# EAGLE schematic OCU_PCB_Rev3 (EAGLE 9.6.2)

## Sheet 1 of 4
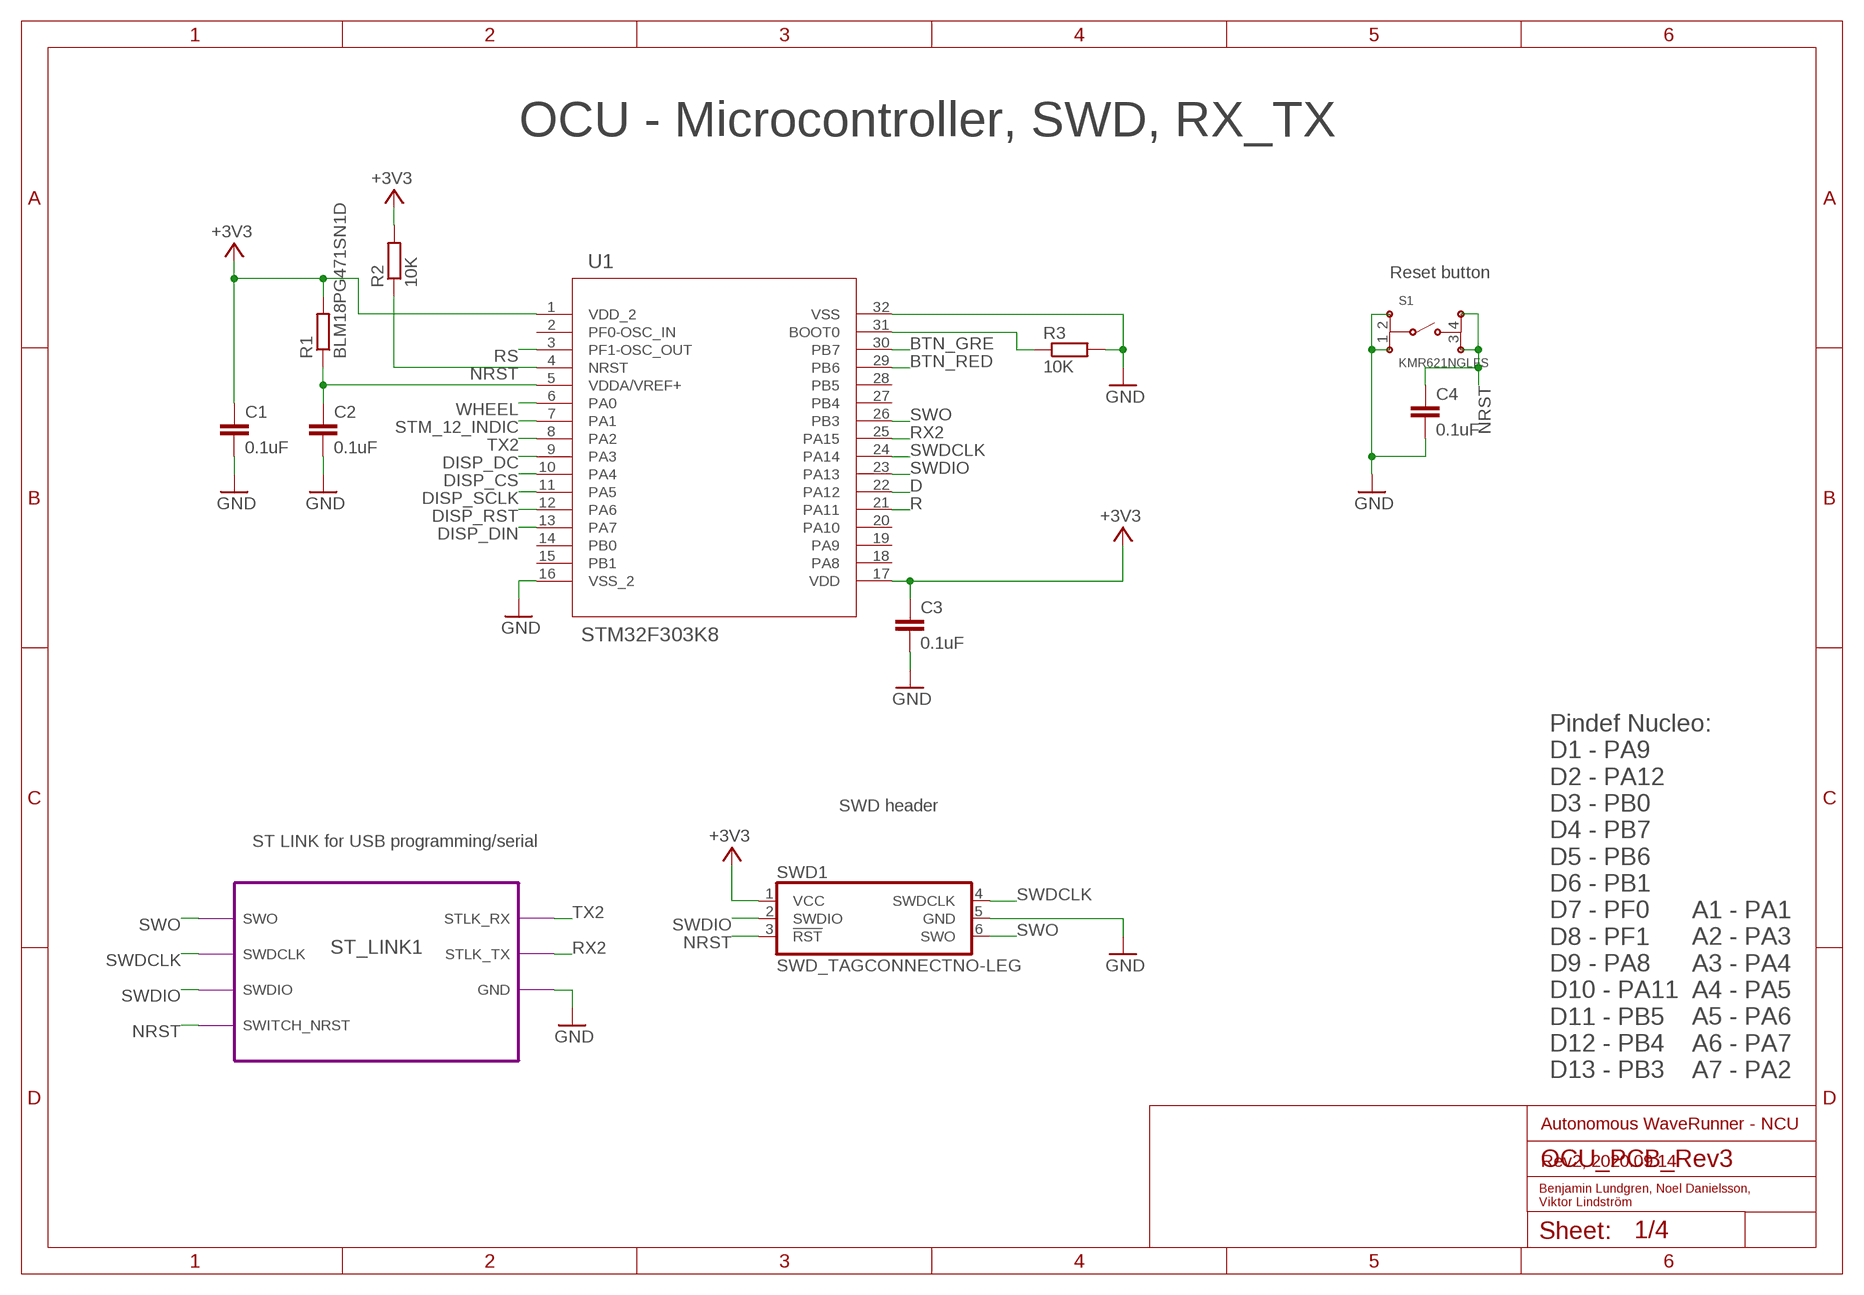
[diagram p0: schematic, sheet 1]

### Parts
C1  0.1uF  C0603  [C0603]
C2  0.1uF  C0603  [C0603]
C3  0.1uF  C0603  [C0603]
C4  0.1uF  C0603  [C0603]
R1  BLM18PG471SN1D  R0603  [R0603]
R2  10K  R0603  [R0603]
R3  10K  R0603  [R0603]
S1  KMR621NGLFS  [KMR621NGLFS]
SWD1  SWD_TAGCONNECTNO-LEG  [TC2030-IDC-NL]
U1  STM32F303K8  [LQFP-32]

### Module instances
ST_LINK1 = ST_LINKV2_1

### Nets
+3V3: C1.1 C3.1 R1.2 R2.2 SWD1.1(VCC) U1.1(VDD_2) U1.17(VDD) ; also sheet 2,3,4
BTN_GRE: U1.30(PB7) ; also sheet 3
BTN_RED: U1.29(PB6) ; also sheet 3
D: U1.22(PA12) ; also sheet 4
DISP_CS: U1.10(PA4) ; also sheet 3
DISP_DC: U1.9(PA3) ; also sheet 3
DISP_DIN: U1.13(PA7) ; also sheet 3
DISP_RST: U1.12(PA6) ; also sheet 3
DISP_SCLK: U1.11(PA5) ; also sheet 3
GND: C1.2 C2.2 C3.2 C4.2 R3.2 S1.1 S1.2 SWD1.5(GND) U1.16(VSS_2) U1.32(VSS) ; port ST_LINK1.GND ; also sheet 2,3,4
N$26: C2.1 R1.1 U1.5(VDDA/VREF+)
N$27: R3.1 U1.31(BOOT0)
NRST: C4.1 R2.1 S1.3 S1.4 SWD1.3(!RST) U1.4(NRST) ; port ST_LINK1.SWITCH_NRST
R: U1.21(PA11) ; also sheet 4
RS: U1.3(PF1-OSC_OUT) ; also sheet 4
RX2: U1.25(PA15) ; port ST_LINK1.STLK_TX
STM_12_INDIC: U1.7(PA1) ; also sheet 2
SWDCLK: SWD1.4(SWDCLK) U1.24(PA14) ; port ST_LINK1.SWDCLK
SWDIO: SWD1.2(SWDIO) U1.23(PA13) ; port ST_LINK1.SWDIO
SWO: SWD1.6(SWO) U1.26(PB3) ; port ST_LINK1.SWO
TX2: U1.8(PA2) ; port ST_LINK1.STLK_RX
WHEEL: U1.6(PA0) ; also sheet 3
Unconnected: U1.2(PF0-OSC_IN) U1.14(PB0) U1.15(PB1) U1.18(PA8) U1.19(PA9) U1.20(PA10) U1.27(PB4) U1.28(PB5)

### Notes on the sheet
- OCU - Microcontroller, SWD, RX_TX
- Reset button
- SWD header
- ST LINK for USB programming/serial
- Pindef Nucleo:
  D1 - PA9
  D2 - PA12
  D3 - PB0
  D4 - PB7
  D5 - PB6
  D6 - PB1
  D7 - PF0
  D8 - PF1
  D9 - PA8
  D10 - PA11
  D11 - PB5
  D12 - PB4
  D13 - PB3
- A1 - PA1
  A2 - PA3
  A3 - PA4
  A4 - PA5
  A5 - PA6
  A6 - PA7
  A7 - PA2
- Autonomous WaveRunner - NCU
- Rev2, 2020.09.14
- Benjamin Lundgren, Noel Danielsson, 
  Viktor Lindström

## Sheet 2 of 4
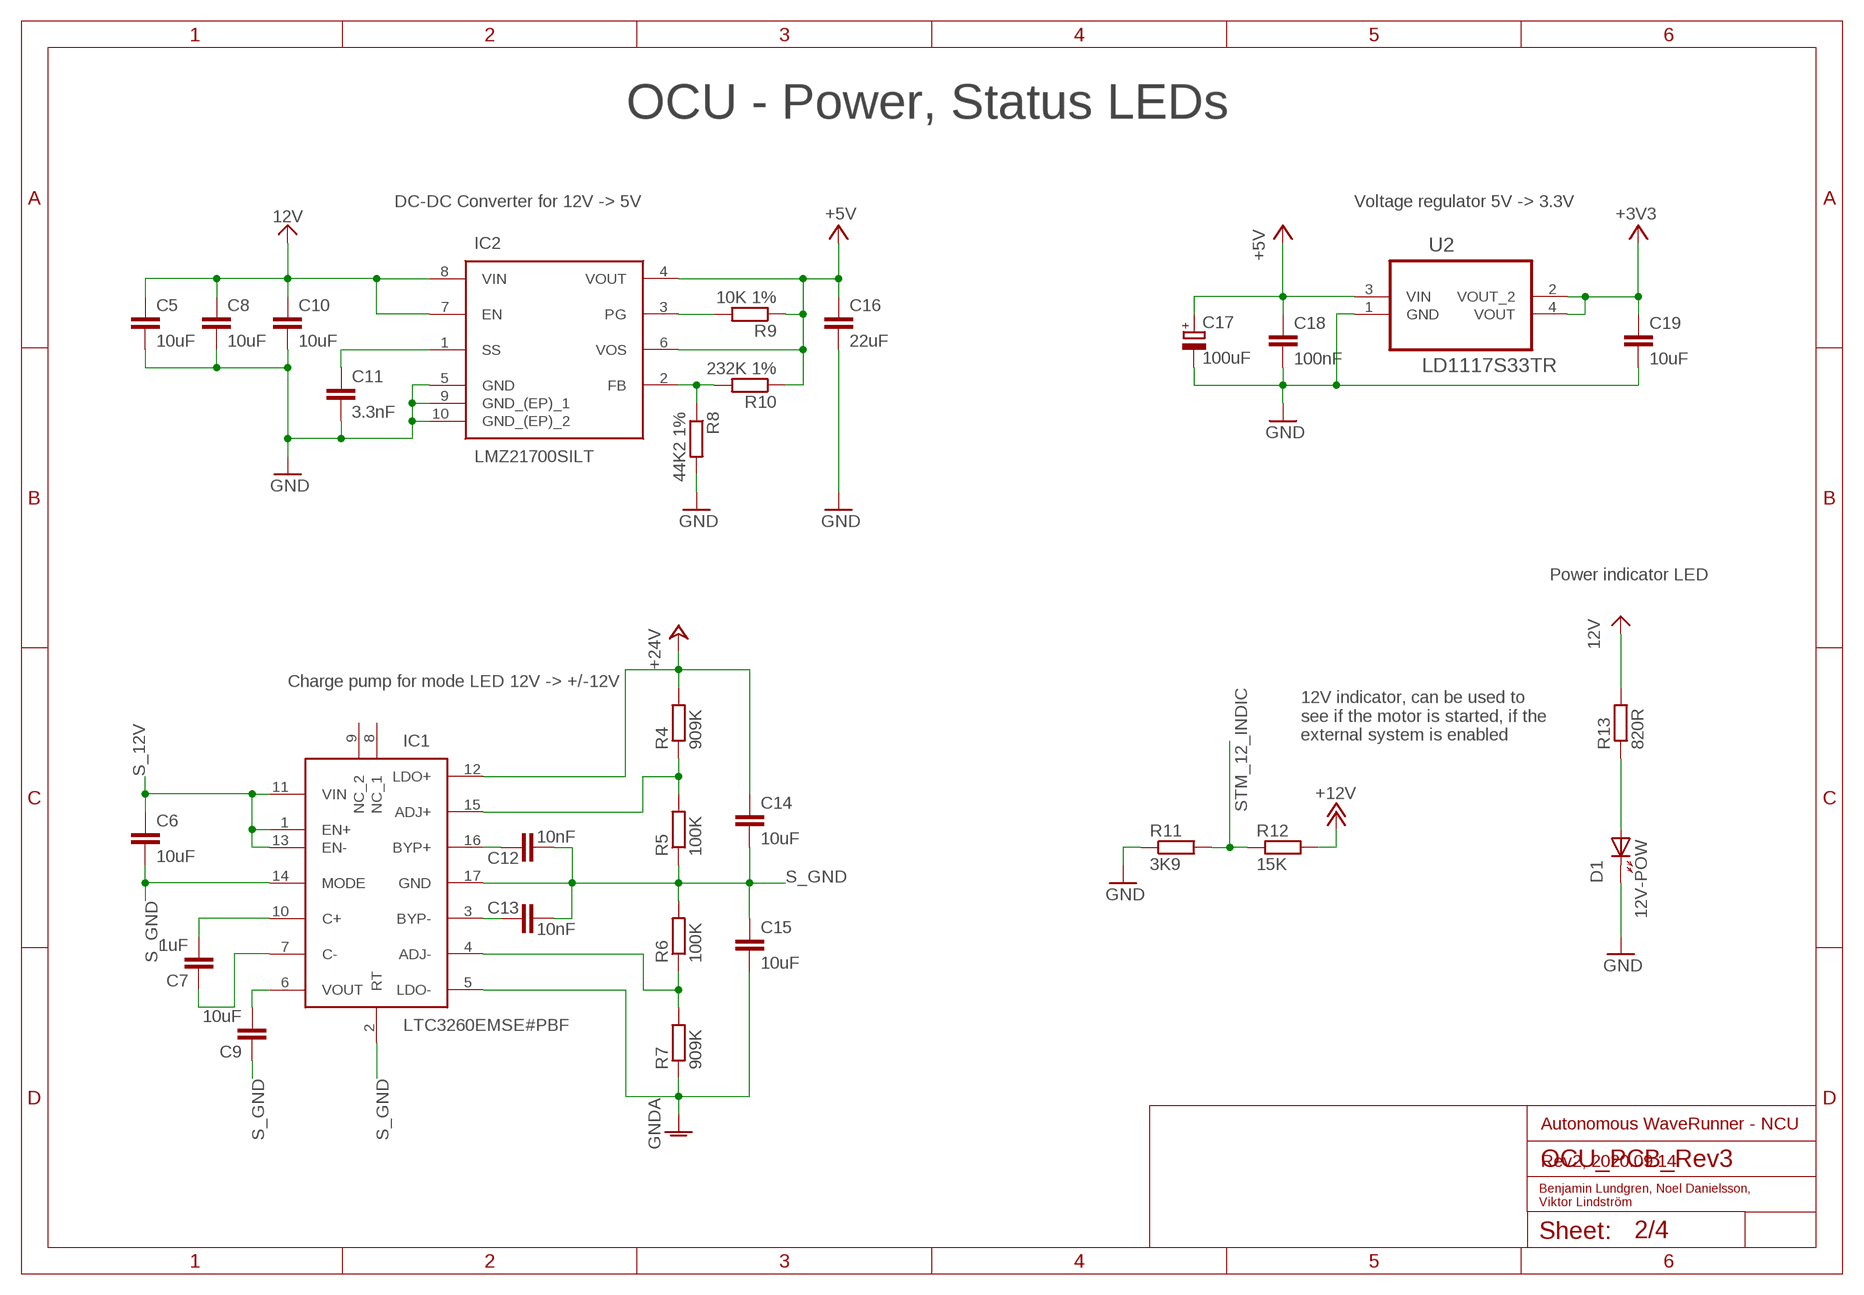
[diagram p1: schematic, sheet 2]

### Parts
C5  10uF  C1206  [C1206]
C6  10uF  C1206  [C1206]
C7  1uF  C0805  [C0805]
C8  10uF  C1206  [C1206]
C9  10uF  C1206  [C1206]
C10  10uF  C1206  [C1206]
C11  3.3nF  C0603  [C0603]
C12  10nF  C0603  [C0603]
C13  10nF  C0603  [C0603]
C14  10uF  C1206  [C1206]
C15  10uF  C1206  [C1206]
C16  22uF  C0805  [C0805]
C17  100uF  PANASONIC_C  [PANASONIC_C]
C18  100nF  C0603  [C0603]
C19  10uF  C0805  [C0805]
D1  12V-POW  CHIP-LED0805  [CHIP-LED0805]
IC1  LTC3260EMSE#PBF  [SOP50P490X110-17N]
IC2  LMZ21700SILT  [SIL0008E]
R4  909K  R0603  [R0603]
R5  100K  R0603  [R0603]
R6  100K  R0603  [R0603]
R7  909K  R0603  [R0603]
R8  44K2 1%  R0603  [R0603]
R9  10K 1%  R0603  [R0603]
R10  232K 1%  R0603  [R0603]
R11  3K9  R0603  [R0603]
R12  15K  R0603  [R0603]
R13  820R  R0603  [R0603]
U2  LD1117S33TR  [SOT230P700X180-4N]

### Nets
12V: C5.1 C8.1 C10.1 IC2.7(EN) IC2.8(VIN) R13.2 ; also sheet 4
+3V3: C19.1 U2.2(VOUT_2) U2.4(VOUT) ; also sheet 1,3,4
+5V: C16.1 C17.+ C18.1 IC2.4(VOUT) IC2.6(VOS) R9.1 R10.1 U2.3(VIN) ; also sheet 3
+12V: R12.2 ; also sheet 4
+24V: C14.1 IC1.12(LDO+) R4.2 ; also sheet 3
GND: C5.2 C8.2 C10.2 C11.2 C16.2 C17.- C18.2 C19.2 D1.C(K) IC2.5(GND) IC2.9(GND_(EP)_1) IC2.10(GND_(EP)_2) R8.2 R11.1 U2.1(GND) ; also sheet 1,3,4
GNDA: C15.2 IC1.5(LDO-) R7.1 ; also sheet 3
N$2: C7.1 IC1.7(C-)
N$3: C7.2 IC1.10(C+)
N$5: IC2.2(FB) R8.1 R10.2
N$6: C11.1 IC2.1(SS)
N$7: C12.1 IC1.16(BYP+)
N$8: C13.1 IC1.3(BYP-)
N$10: D1.A R13.1
N$11: IC2.3(PG) R9.2
N$13: C9.2 IC1.6(VOUT)
N$14: IC1.15(ADJ+) R4.1 R5.2
N$16: IC1.4(ADJ-) R6.1 R7.2
S_12V: C6.1 IC1.1(EN+) IC1.11(VIN) IC1.13(EN-) ; also sheet 3
S_GND: C6.2 C9.1 C12.2 C13.2 C14.2 C15.1 IC1.2(RT) IC1.14(MODE) IC1.17(GND) R5.1 R6.2 ; also sheet 3
STM_12_INDIC: R11.2 R12.1 ; also sheet 1
Unconnected: IC1.8(NC_1) IC1.9(NC_2)

### Notes on the sheet
- OCU - Power, Status LEDs
- DC-DC Converter for 12V -> 5V | Voltage regulator 5V -> 3.3V
- Power indicator LED
- Charge pump for mode LED 12V -> +/-12V
- 12V indicator, can be used to
  see if the motor is started, if the 
  external system is enabled
- Autonomous WaveRunner - NCU
- Rev2, 2020.09.14
- Benjamin Lundgren, Noel Danielsson, 
  Viktor Lindström

## Sheet 3 of 4
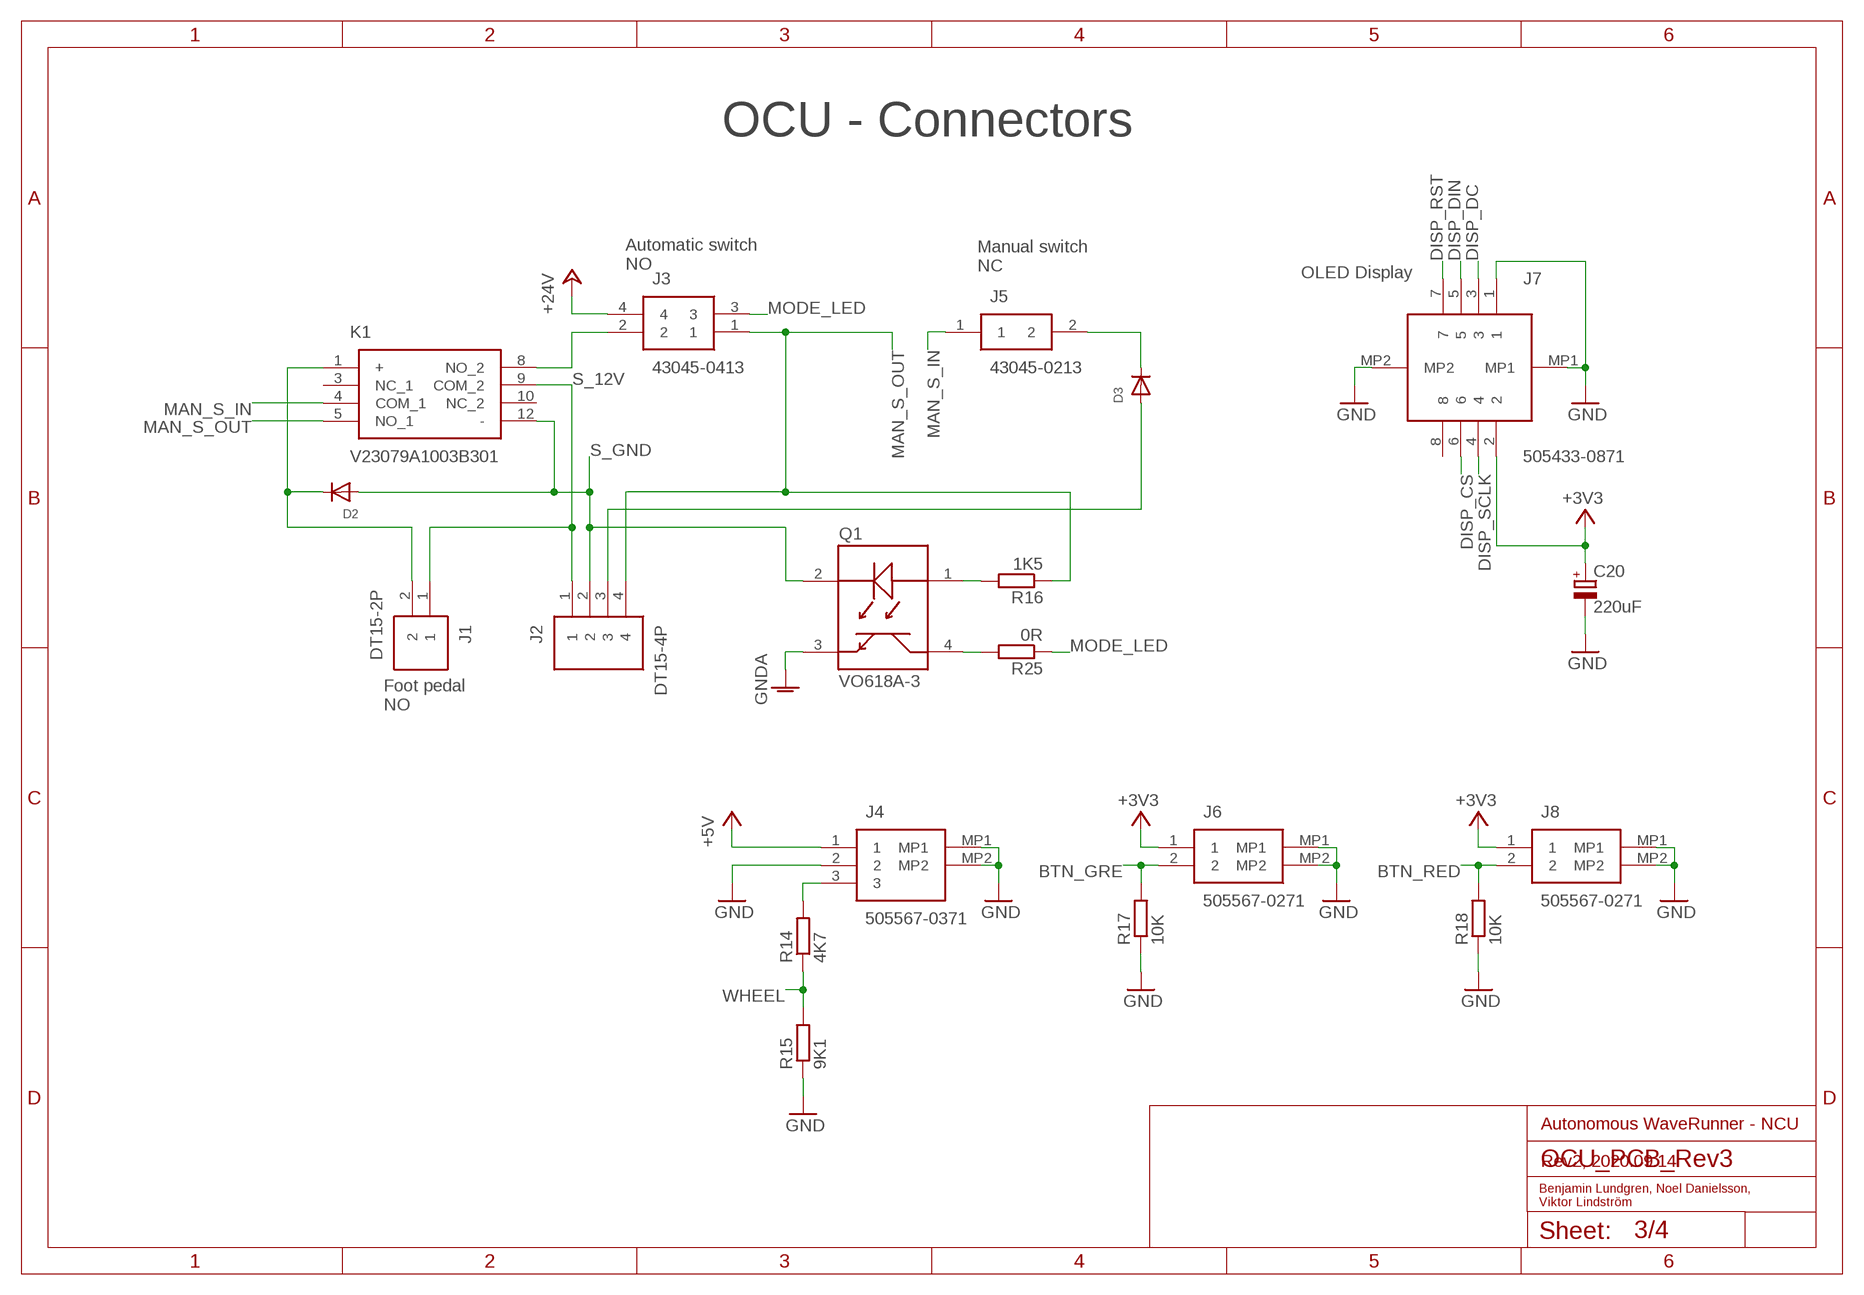
[diagram p2: schematic, sheet 3]

### Parts
C20  220uF  PANASONIC_E  [PANASONIC_E]
D2  DIODESOD-123  [SOD-123]
D3  DIODESOD-123  [SOD-123]
J1  DT15-2P  [DT152P]
J2  DT15-4P  [DT154P]
J3  43045-0413  [430450413]
J4  505567-0371  [5055680371]
J5  43045-0213  [43045-0213]
J6  505567-0271  [5055680271]
J7  505433-0871  [5054330871]
J8  505567-0271  [5055680271]
K1  V23079A1003B301  [413937885]
Q1  VO618A-3  [DIL04-400]
R14  4K7  R0603  [R0603]
R15  9K1  R0603  [R0603]
R16  1K5  R0603  [R0603]
R17  10K  R0603  [R0603]
R18  10K  R0603  [R0603]
R25  0R  R0603  [R0603]

### Nets
+3V3: C20.+ J6.1 J7.2 J8.1 ; also sheet 1,2,4
+5V: J4.1 ; also sheet 2
+24V: J3.4 ; also sheet 2
BTN_GRE: J6.2 R17.2 ; also sheet 1
BTN_RED: J8.2 R18.2 ; also sheet 1
DISP_CS: J7.6 ; also sheet 1
DISP_DC: J7.3 ; also sheet 1
DISP_DIN: J7.5 ; also sheet 1
DISP_RST: J7.7 ; also sheet 1
DISP_SCLK: J7.4 ; also sheet 1
GND: C20.- J4.2 J4.MP1 J4.MP2 J6.MP1 J6.MP2 J7.1 J7.MP1 J7.MP2 J8.MP1 J8.MP2 R15.1 R17.1 R18.1 ; also sheet 1,2,4
GNDA: Q1.3(3E) ; also sheet 2
MAN_S_IN: J5.1 K1.4(COM_1)
MAN_S_OUT: J2.4 J3.1 K1.5(NO_1) R16.1
MODE_LED: J3.3 R25.1
N$1: J4.3 R14.2
N$9: D3.C J5.2
N$12: J3.2 K1.8(NO_2)
N$17: Q1.4(4C) R25.2
N$18: D3.A J2.3
N$22: Q1.1(1A) R16.2
N$24: D2.C J1.2 K1.1(+)
S_12V: J1.1 J2.1 K1.9(COM_2) ; also sheet 2
S_GND: D2.A J2.2 K1.12(-) Q1.2(2C) ; also sheet 2
WHEEL: R14.1 R15.2 ; also sheet 1
Unconnected: J7.8 K1.3(NC_1) K1.10(NC_2)

### Notes on the sheet
- OCU - Connectors
- Automatic switch
  NO
- Manual switch
  NC
- OLED Display
- Foot pedal
  NO
- Autonomous WaveRunner - NCU
- Rev2, 2020.09.14
- Benjamin Lundgren, Noel Danielsson, 
  Viktor Lindström

## Sheet 4 of 4
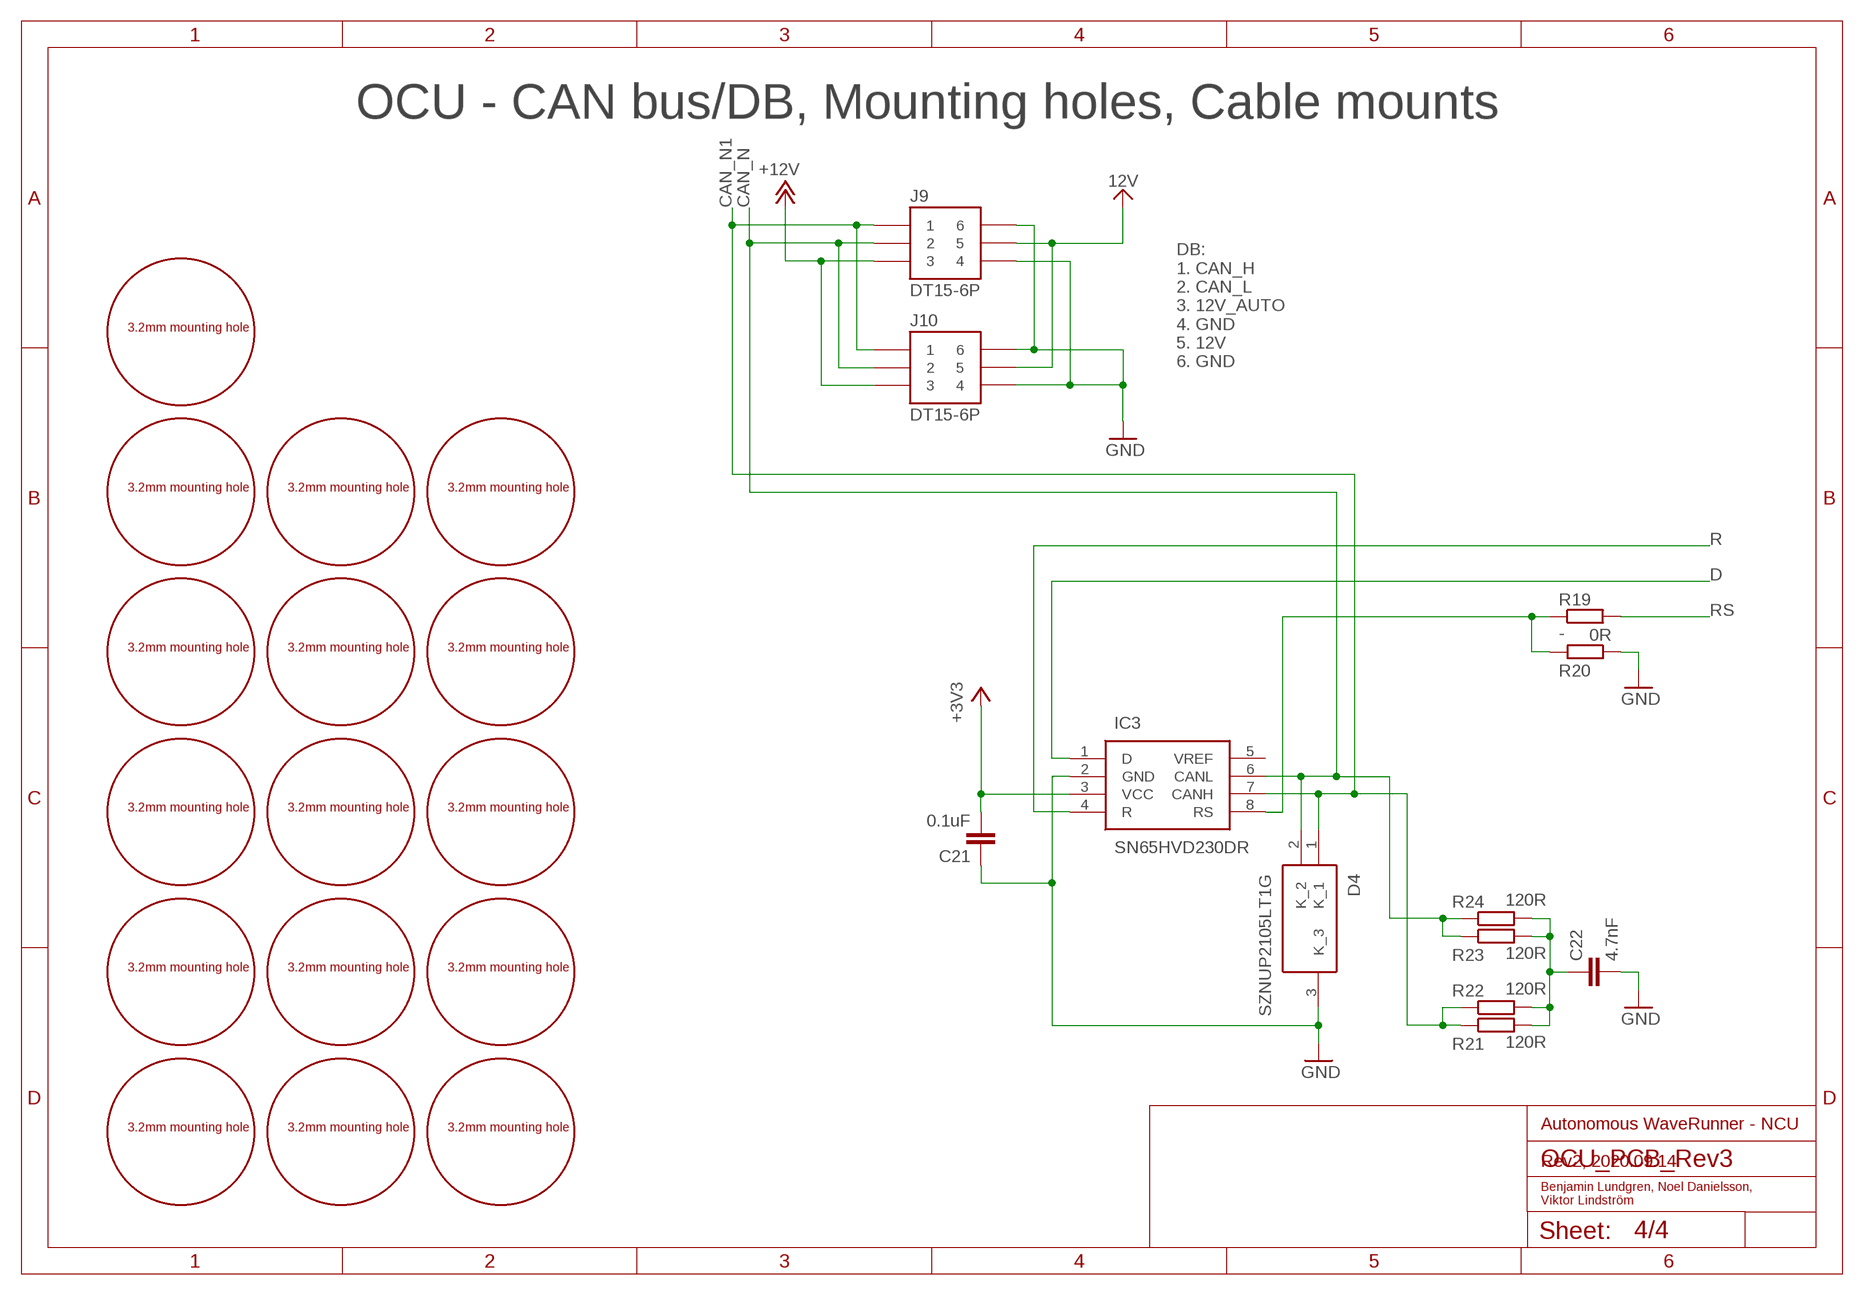
[diagram p3: schematic, sheet 4]

### Parts
C21  0.1uF  C0603  [C0603]
C22  4.7nF  C0805  [C0805]
D4  SZNUP2105LT1G  [SOT96P237X111-3N]
HOLE1  M3_MOUNTING_HOLE  [M3_MOUNTING_HOLE]
HOLE2  M3_MOUNTING_HOLE  [M3_MOUNTING_HOLE]
HOLE3  M3_MOUNTING_HOLE  [M3_MOUNTING_HOLE]
HOLE4  M3_MOUNTING_HOLE  [M3_MOUNTING_HOLE]
HOLE5  M3_MOUNTING_HOLE  [M3_MOUNTING_HOLE]
HOLE6  M3_MOUNTING_HOLE  [M3_MOUNTING_HOLE]
HOLE7  M3_MOUNTING_HOLE  [M3_MOUNTING_HOLE]
HOLE8  M3_MOUNTING_HOLE  [M3_MOUNTING_HOLE]
HOLE9  M3_MOUNTING_HOLE  [M3_MOUNTING_HOLE]
HOLE10  M3_MOUNTING_HOLE  [M3_MOUNTING_HOLE]
HOLE11  M3_MOUNTING_HOLE  [M3_MOUNTING_HOLE]
HOLE12  M3_MOUNTING_HOLE  [M3_MOUNTING_HOLE]
HOLE13  M3_MOUNTING_HOLE  [M3_MOUNTING_HOLE]
HOLE14  M3_MOUNTING_HOLE  [M3_MOUNTING_HOLE]
HOLE15  M3_MOUNTING_HOLE  [M3_MOUNTING_HOLE]
HOLE16  M3_MOUNTING_HOLE  [M3_MOUNTING_HOLE]
IC3  SN65HVD230DR  [SOT127P600X175-8N]
J9  DT15-6P  [TE_DT15-6P]
J10  DT15-6P  [TE_DT15-6P]
R19  -  R0603  [R0603]
R20  0R  R0603  [R0603]
R21  120R  R-EU_R1210  [R1210]
R22  120R  R-EU_R1210  [R1210]
R23  120R  R-EU_R1210  [R1210]
R24  120R  R-EU_R1210  [R1210]

### Nets
12V: J9.5 J10.5 ; also sheet 2
+3V3: C21.2 IC3.3(VCC) ; also sheet 1,2,3
+12V: J9.3 J10.3 ; also sheet 2
CAN_N: D4.2(K_2) IC3.6(CANL) J9.2 J10.2 R23.1 R24.1
CAN_N1: D4.1(K_1) IC3.7(CANH) J9.1 J10.1 R21.1 R22.1
D: IC3.1(D) ; also sheet 1
GND: C21.1 C22.2 D4.3(K_3) IC3.2(GND) J9.4 J9.6 J10.4 J10.6 R20.1 ; also sheet 1,2,3
N$4: C22.1 R21.2 R22.2 R23.2 R24.2
N$15: IC3.8(RS) R19.1 R20.2
R: IC3.4(R) ; also sheet 1
RS: R19.2 ; also sheet 1
Unconnected: IC3.5(VREF)

### Notes on the sheet
- OCU - CAN bus/DB, Mounting holes, Cable mounts
- DB:
  1. CAN_H
  2. CAN_L
  3. 12V_AUTO
  4. GND
  5. 12V
  6. GND
- Autonomous WaveRunner - NCU
- Rev2, 2020.09.14
- Benjamin Lundgren, Noel Danielsson, 
  Viktor Lindström

## Library data of the parts
C1-C4 C11-C13 C18 C21 = CASE-RCL:C0603: Standard Chip CAPACITOR 0605 (1608 Metric) Description: Standard Chip CAPACITOR 0605 (1608 Metric)
C5 C6 C8-C10 C14 C15 = CASE-RCL:C1206: Standard Chip CAPACITOR 1206 (3216 Metric) Description: Standard Chip CAPACITOR 1206 (3216 Metric)
C7 C16 C19 C22 = CASE-RCL:C0805: Standard Chip CAPACITOR 0805 (2012 Metric) Description: Standard Chip CAPACITOR 0805 (2012 Metric)
C17 = CASE-RCL:PANASONIC_C: Panasonic VS Type Aluminum Electrolytic SMD Capacitors Size C - (TEAPO D5) Description: Size C of VS type SMD capacitor from Panasonic. Diameter of cap = 5mm. (TEAPO D5) Links: TEAPO1 <http://www.farnell.com/datasheets/2622415.pdf?_ga=2.91453018.1951585514.1537363662-1535130828.1530438260> TEAPO2 <http://www.teapo.com.tw/WebSiteFile/Products/Product_Data/EV%20%20SPEC.pdf> PANASONIC <https://industrial.panasonic.com/cdbs/www-data/pdf/RDE0000/DME0000COL92.pdf>
C20 = CASE-RCL:PANASONIC_E: Panasonic VS Type Aluminum Electrolytic SMD Capacitors Size E Description: Size E of VS type SMD capacitor from Panasonic. Diameter of cap = 8mm. Links: PANASONIC <https://industrial.panasonic.com/cdbs/www-data/pdf/RDE0000/DME0000COL92.pdf>
D1 = CASE-LED:CHIP-LED0805: CHIP-LED0805 (SMD) Description: Standard 0805 SMD CHIP-LED
D2 D3 = adafruit:DIODE: Diode SMADIODE - SMA Surface Mount Package 20V 1A Schottky Diode Digikey: 641-1014-6-ND DO-1N4148 - Through Hole Small Current Diode SOD-123 20V 1 A (.5mV Vf) Schottky Diode - Digikey: MBRX120TPMSCT-ND SOD-323 10V 570mA (.38mV Vf, 3ns) Schottky Diode - Digikey: ZLLS410CT-ND SOD-523 30V 30mA Schottky Diode (RB751S-40TE61) - Digikey: RB751S-40TE61CT-ND SOT23-R/W - SOT23 Package (R = Solder Paste/Reflow Ovens, W = Hand-Soldering) BAT54Film 40V 300mA - Digikey: 497-7162-1-ND
D4 = RescueRunner:SZNUP2105LT1G: Dual Bi-Directional TVS Diode, 350W peak, 3-pin SOT-23 Source: Datasheet <https://componentsearchengine.com/Datasheets/1/SZNUP2105LT1G.pdf>; DESCRIPTION: Dual Bi-Directional TVS Diode, 350W peak, 3-pin SOT-23; HEIGHT: 1.11mm; MANUFACTURER_NAME: ON Semiconductor; MANUFACTURER_PART_NUMBER: SZNUP2105LT1G; MOUSER_PART_NUMBER: 863-SZNUP2105LT1G; MOUSER_PRICE-STOCK: https://www.mouser.com/Search/Refine.aspx?Keyword=863-SZNUP2105LT1G
HOLE1-HOLE16 = RescueRunner:M3_MOUNTING_HOLE
IC1 = RescueRunner:LTC3260EMSE#PBF: LTC3260,Charge Pump Inverter,MSOP EP-16 Linear Technology LTC3260EMSE#PBF, Charge Pump Inverting 100mA 550 kHz, -4.5 -32 V, 16-Pin, MSOP Source: Datasheet <http://uk.rs-online.com/web/p/products/8516768P>; DESCRIPTION: LTC3260,Charge Pump Inverter,MSOP EP-16 Linear Technology LTC3260EMSE#PBF, Charge Pump Inverting 100mA 550 kHz, -4.5 -32 V, 16-Pin, MSOP; HEIGHT: 1.1mm; MANUFACTURER_NAME: Linear Technology; MANUFACTURER_PART_NUMBER: LTC3260EMSE#PBF; RS_PART_NUMBER: 8516768P; RS_PRICE-STOCK: http://uk.rs-online.com/web/p/products/8516768P
IC2 = RescueRunner:LMZ21700SILT: 3V to 17V, 0.65A Step-Down DC/DC Power Module in 3.5mm 3.5mm Package Source: Datasheet <http://uk.rs-online.com/web/p/products/9009750P>; DESCRIPTION: 3V to 17V, 0.65A Step-Down DC/DC Power Module in 3.5mm 3.5mm Package; HEIGHT: mm; MANUFACTURER_NAME: Texas Instruments; MANUFACTURER_PART_NUMBER: LMZ21700SILT; RS_PART_NUMBER: 9009750P; RS_PRICE-STOCK: http://uk.rs-online.com/web/p/products/9009750P
IC3 = RescueRunner:SN65HVD230DR: 3.3 V CAN Transceiver with Standby Mode Source: Datasheet <http://www.ti.com/lit/gpn/sn65hvd230>; DESCRIPTION: 3.3 V CAN Transceiver with Standby Mode; HEIGHT: 1.75mm; MANUFACTURER_NAME: Texas Instruments; MANUFACTURER_PART_NUMBER: SN65HVD230DR; MOUSER_PART_NUMBER: 595-SN65HVD230DR; MOUSER_PRICE-STOCK: https://www.mouser.com/Search/Refine.aspx?Keyword=595-SN65HVD230DR
J1 = RescueRunner:DT15-2P: Deutsch DT15 Series, 5.46mm Pitch 2 Way 1 Row Straight PCB Header, Solder Termination Source: Datasheet <http://uk.rs-online.com/web/p/products/7242529>; ALLIED_NUMBER: 70696153; DESCRIPTION: Deutsch DT15 Series, 5.46mm Pitch 2 Way 1 Row Straight PCB Header, Solder Termination; HEIGHT: 30.99mm; MANUFACTURER_NAME: TE Connectivity; MANUFACTURER_PART_NUMBER: DT15-2P; RS_PART_NUMBER: 7242529; RS_PRICE-STOCK: http://uk.rs-online.com/web/p/products/7242529
J2 = RescueRunner:DT15-4P: Deutsch DT15 Series, 4.44mm Pitch 4 Way 2 Row Straight PCB Header, Solder Termination Source: Datasheet <http://uk.rs-online.com/web/p/products/7242532>; ALLIED_NUMBER: 70696154; DESCRIPTION: Deutsch DT15 Series, 4.44mm Pitch 4 Way 2 Row Straight PCB Header, Solder Termination; HEIGHT: 30.35mm; MANUFACTURER_NAME: TE Connectivity; MANUFACTURER_PART_NUMBER: DT15-4P; RS_PART_NUMBER: 7242532; RS_PRICE-STOCK: http://uk.rs-online.com/web/p/products/7242532
J3 = RescueRunner:43045-0413: Micro-Fit 3.0 Vertical Header, 3.00mm Pitch, Dual Row, Circuits, with PCB Polarizing Peg, Tin, Glow-Wire Capable, Black Source: Datasheet <http://uk.rs-online.com/web/p/products/6700333P>; ALLIED_NUMBER: 70090720; DESCRIPTION: Micro-Fit 3.0 Vertical Header, 3.00mm Pitch, Dual Row, Circuits, with PCB Polarizing Peg, Tin, Glow-Wire Capable, Black; HEIGHT: 10.16mm; MANUFACTURER_NAME: Molex; MANUFACTURER_PART_NUMBER: 43045-0413; RS_PART_NUMBER: 6700333P; RS_PRICE-STOCK: http://uk.rs-online.com/web/p/products/6700333P
J4 = RescueRunner:505567-0371: Horizontal
J5 = RescueRunner:43045-0213: Header 3.00mm, WTB, dual row, vert,2w Molex MICRO-FIT 3.0 Series, Series Number 43045, 3mm Pitch 2 Way 2 Row Straight PCB Header, Solder Termination, 5A Source: Datasheet <http://uk.rs-online.com/web/p/products/6700305P>; ALLIED_NUMBER: 70090781; DESCRIPTION: Header 3.00mm, WTB, dual row, vert,2w Molex MICRO-FIT 3.0 Series, Series Number 43045, 3mm Pitch 2 Way 2 Row Straight PCB Header, Solder Termination, 5A; HEIGHT: mm; MANUFACTURER_NAME: Molex; MANUFACTURER_PART_NUMBER: 43045-0213; RS_PART_NUMBER: 6700305P; RS_PRICE-STOCK: http://uk.rs-online.com/web/p/products/6700305P
J6 J8 = RescueRunner:505567-0271: Horizontal
J7 = RescueRunner:505433-0871: CONN HEADER SMD 8POS 1.25MM Source: Datasheet <https://www.molex.com/pdm_docs/sd/5054330871_sd.pdf>; DESCRIPTION: CONN HEADER SMD 8POS 1.25MM; HEIGHT: 7.25mm; MANUFACTURER_NAME: Molex; MANUFACTURER_PART_NUMBER: 5054330871
J9 J10 = RescueRunner:DT15-6P: DT15 Series, 4.44mm Pitch 6 Way 2 Row Straight PCB Header, Solder Termination; AVAILABILITY: Unavailable; COMMENT: DT15-6P; DESCRIPTION: DT15 Series, 4.44mm Pitch 6 Way 2 Row Straight PCB Header, Solder Termination; MAXIMUM_PACKAGE_HEIGHT: 15.75mm; MF: TE Connectivity; MP: DT15-6P; PACKAGE: None; PARTREV: C1; PRICE: None; STANDARD: IPC-7351B; TE_PURCHASE_URL: https://www.te.com/usa-en/product-DT15-6P.html?te_bu=Cor&te_type=disp&te_campaign=seda_glo_cor-seda-global-disp-prtnr-fy19-seda-model-bom-cta_sma-317_1&elqCampaignId=32493
K1 = CASE-Relay:V23079A1003B301: V23079-A1003-B301 - DPDT non latch signal relay, 12VDC Description: V23079-A1003-B301 - DPDT non latch signal relay, through hole, 12VDC, 2A Rated current. Links: Datasheet <http://www.farnell.com/datasheets/1918069.pdf?_ga=2.91596121.236001324.1551687660-368635712.1550490484>; DESCRIPTION: DPDT non latch PCB relay, 5A 12Vdc coil; HEIGHT: 9mm; MANUFACTURER_NAME: TE Connectivity; MANUFACTURER_PART_NUMBER: V23079A1003B301; MOUSER_PART_NUMBER: 655-V23079A1003B301; MOUSER_PRICE-STOCK: https://www.mouser.com/Search/Refine.aspx?Keyword=655-V23079A1003B301
Q1 = CASE-Optocoupler:VO618A-3: VO618A-3 Description: VISHAY VO618A-3 Optocoupler in DIP-4 package. Links: Datasheet <http://www.farnell.com/datasheets/2049960.pdf?_ga=2.25273981.1789882356.1554397115-114062766.1547494298>
R1-R20 R25 = CASE-RCL:R0603: Standard Chip RESISTOR 0603 (1608 Metric) Description: Standard Chip RESISTOR 0603 (1608 Metric)
R21-R24 = rcl:R-EU_: RESISTOR, European symbol; SPICEPREFIX: R
S1 = CASE-Switches:KMR621NGLFS: C&K KMR621NG LFS Tactile SPST switch (SMD) Description: C&K KMR621NG LFS Tactile SPST switch SMD package. Links: KMR621NG LFS <http://www.farnell.com/datasheets/2706242.pdf?_ga=2.40597409.2071720333.1546461288-1112771566.1525371275>
SWD1 = CASE-Prog_Header:SWD_TAGCONNECT: SWD Programming header (Tag-Connect version) Description: SWD Programming header for Tag Connect TC2030-IDC, both legged and no-legged version Links: Tag-Connect <http://www.tag-connect.com/JLINK>
U1 = CASE-MCU:STM32F303K8: STM32F303K8, LQFP-32 Description: STM32F303K8 from STMicroelectronics F3 series (Arm Cortex M4), LQFP-32 package Links: Datasheet <https://www.st.com/resource/en/datasheet/stm32f303k8.pdf> Website <https://www.st.com/en/microcontrollers/stm32f303k8.html> NUCLEO-F303K8 <https://www.st.com/en/evaluation-tools/nucleo-f303k8.html>; MANUFACTURER_PART_NUMBER: stm32f303_334kxt; VENDOR: STMicroelectronics
U2 = CASE-Voltage_regulators:LD1117S33TR: LD1117S33TR, 3.3V LDO voltage regulator, SOT-223-4 Description: LD1117S33TR, 3.3V LDO voltage regulator in SOT-223-3 package - Input voltage: 4.75-15V - Output voltage: 3.3V - Output current: 800mA - Dropout voltage: 1.1V Links: Datasheet <http://www.farnell.com/datasheets/1776449.pdf?_ga=2.71508627.1869469127.1547838600-114062766.1547494298>; MPN: LD1117S33TR; OC_FARNELL: 2253484; OC_NEWARK: 89K0627; PACKAGE: SOT223-3; SUPPLIER: STMicroelectronics

## Module ST_LINKV2_1
Ports: SWITCH_NRST(io) GND(io) STLK_RX(io) STLK_TX(io) SWDIO(io) SWDCLK(io) SWO(io)
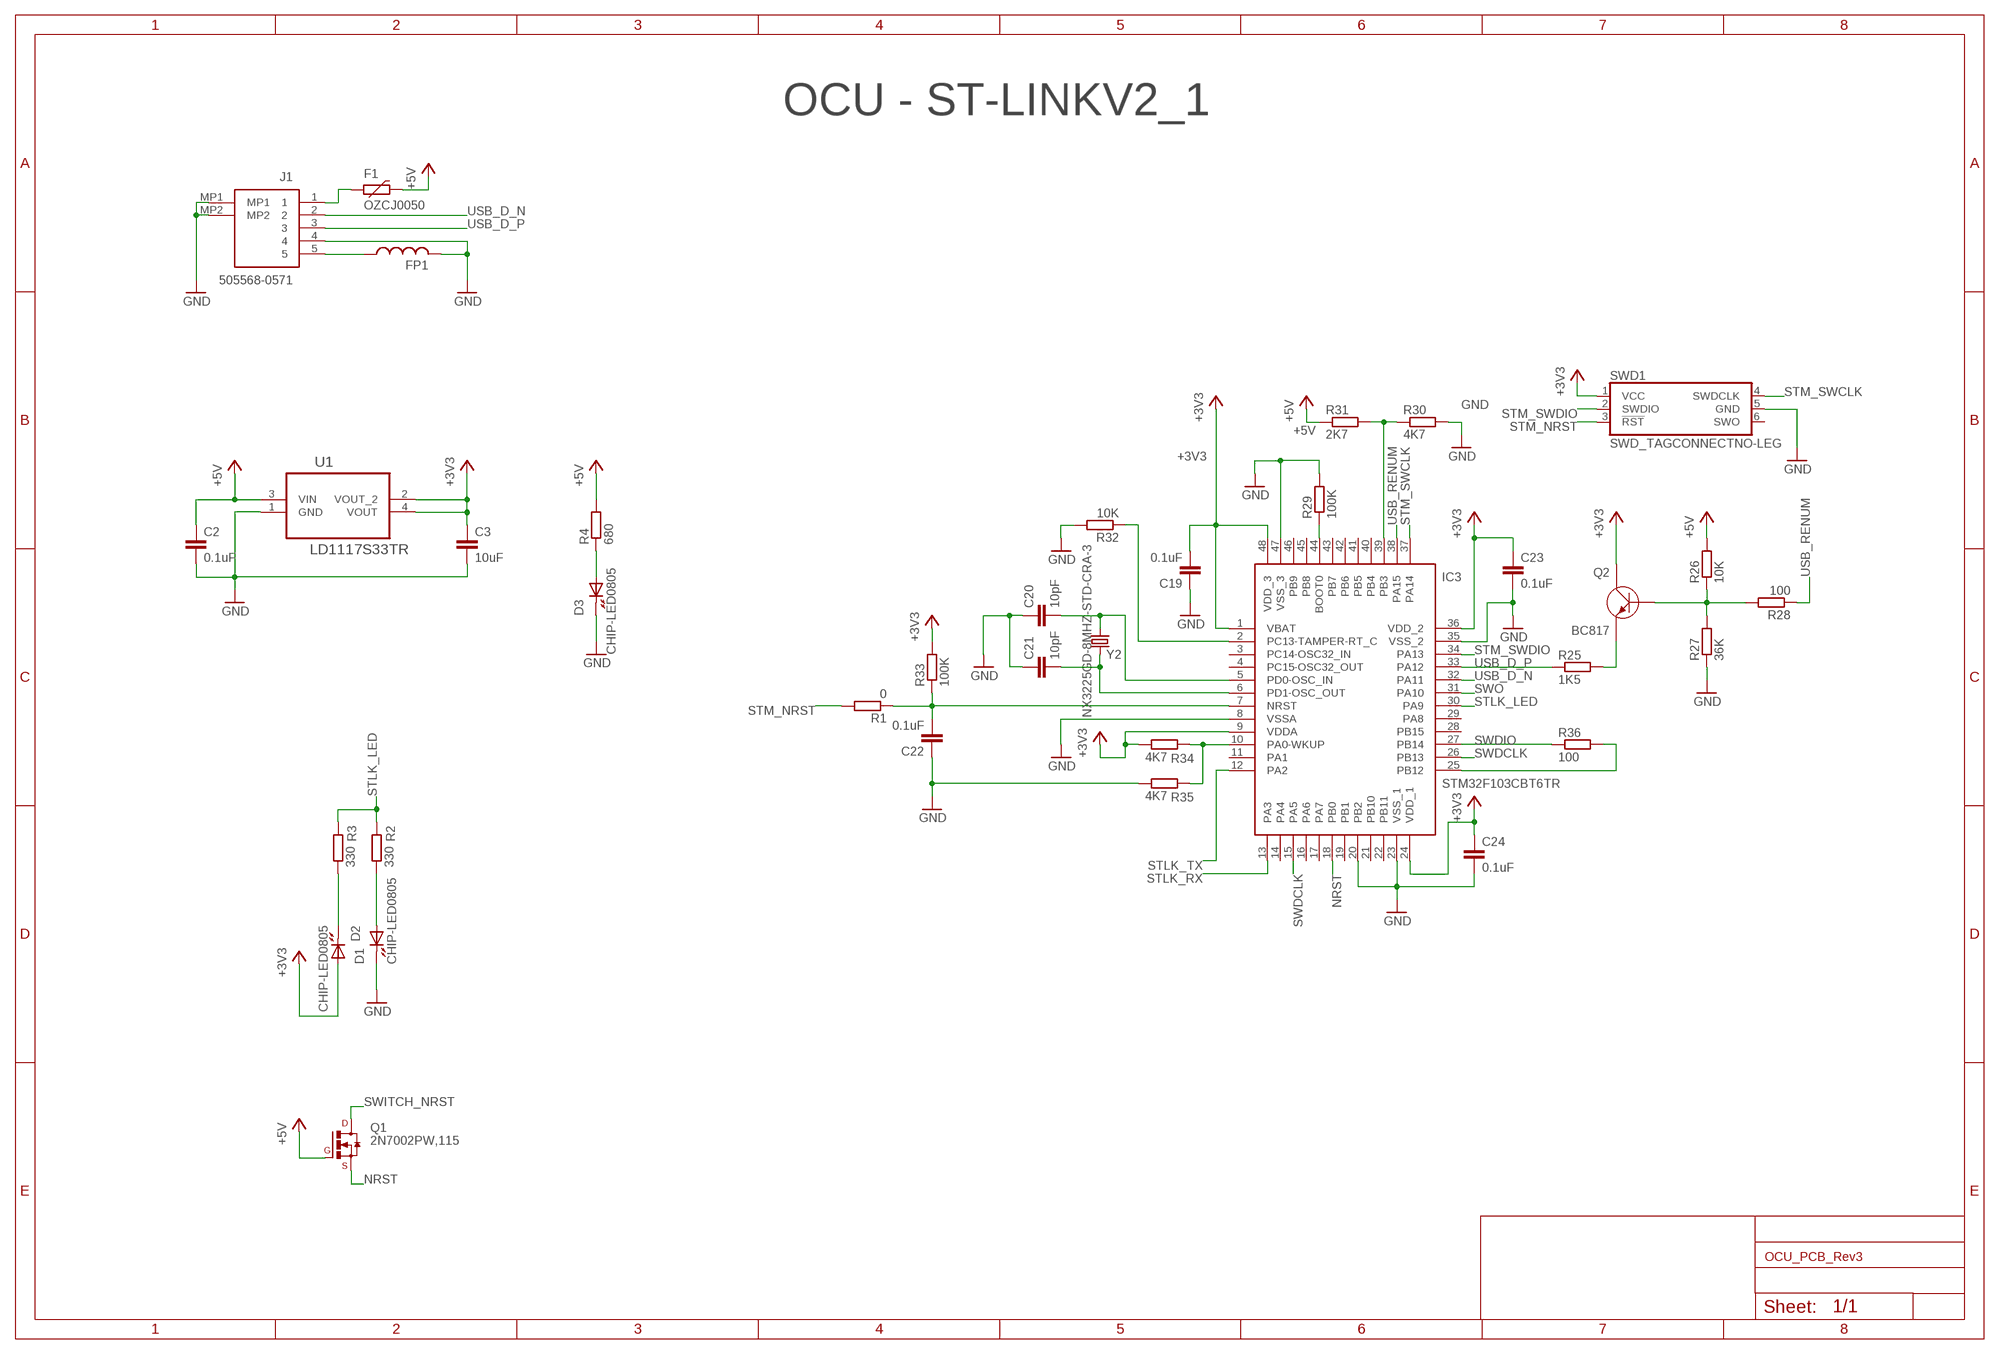
[diagram p4: schematic, module ST_LINKV2_1, sheet 1]

### Parts
C2  0.1uF  C0603  [C0603]
C3  10uF  C0603  [C0603]
C19  0.1uF  C0603  [C0603]
C20  10pF  C0603  [C0603]
C21  10pF  C0603  [C0603]
C22  0.1uF  C0603  [C0603]
C23  0.1uF  C0603  [C0603]
C24  0.1uF  C0603  [C0603]
D1  CHIP-LED0805  [CHIP-LED0805]
D2  CHIP-LED0805  [CHIP-LED0805]
D3  CHIP-LED0805  [CHIP-LED0805]
F1  OZCJ0050  OZCJ  [OZCJ]
FP1  BLM18A  [R0603]
IC3  STM32F103CBT6TR  [QFP50P900X900X160-48N]
J1  505568-0571  [5055680571]
Q1  2N7002PW,115  [SOT323]
Q2  BC817  [SOT23]
R1  0  R0603  [R0603]
R2  330  R0603  [R0603]
R3  330  R0603  [R0603]
R4  680  R0603  [R0603]
R25  1K5  R0603  [R0603]
R26  10K  R0603  [R0603]
R27  36K  R0603  [R0603]
R28  100  R0603  [R0603]
R29  100K  R0603  [R0603]
R30  4K7  R0603  [R0603]
R31  2K7  R0603  [R0603]
R32  10K  R0603  [R0603]
R33  100K  R0603  [R0603]
R34  4K7  R0603  [R0603]
R35  4K7  R0603  [R0603]
R36  100  R0805  [R0805]
SWD1  SWD_TAGCONNECTNO-LEG  [TC2030-IDC-NL]
U1  LD1117S33TR  [SOT230P700X180-4N]
Y2  NX3225GD-8MHZ-STD-CRA-3  [RESC3226X100N]

### Nets
+3V3: C3.1 C19.2 C23.1 C24.1 D2.A IC3.1(VBAT) IC3.9(VDDA) IC3.24(VDD_1) IC3.36(VDD_2) IC3.48(VDD_3) Q2.3(C) R33.2 R34.1 SWD1.1(VCC) U1.2(VOUT_2) U1.4(VOUT)
+5V: C2.1 F1.1 Q1.1(G) R4.2 R26.2 R31.1 U1.3(VIN)
GND: C2.2 C3.2 C19.1 C20.1 C21.1 C22.1 C23.2 C24.2 D1.C(K) D3.C(K) FP1.2 IC3.8(VSSA) IC3.20(PB2) IC3.23(VSS_1) IC3.35(VSS_2) IC3.47(VSS_3) J1.4 J1.MP1 J1.MP2 R27.1 R29.2 R30.2 R32.2 R35.1 SWD1.5(GND) U1.1(GND)
N$1: D1.A R2.1
N$2: D3.A R4.1
N$3: D2.C(K) R3.1
N$4: FP1.1 J1.5
N$7: Q2.2(E) R25.2
N$8: Q2.1(B) R26.1 R27.2 R28.2
N$15: IC3.39(PB3) R30.1 R31.2
N$16: IC3.2(PC13-TAMPER-RT_C) R32.1
N$21: IC3.44(BOOT0) R29.1
N$22: C20.2 IC3.5(PD0-OSC_IN) Y2.1
N$23: IC3.10(PA0-WKUP) R34.2 R35.2
N$24: C21.2 IC3.6(PD1-OSC_OUT) Y2.2
N$25: C22.2 IC3.7(NRST) R1.1 R33.1
N$26: IC3.25(PB12) R36.2
N$27: F1.2 J1.1
NRST: IC3.18(PB0) Q1.2(S)
STLK_LED: IC3.30(PA9) R2.2 R3.2
STLK_RX: IC3.13(PA3)
STLK_TX: IC3.12(PA2)
STM_NRST: R1.2 SWD1.3(!RST)
STM_SWCLK: IC3.37(PA14) SWD1.4(SWDCLK)
STM_SWDIO: IC3.34(PA13) SWD1.2(SWDIO)
SWDCLK: IC3.15(PA5) IC3.26(PB13)
SWDIO: IC3.27(PB14) R36.1
SWITCH_NRST: Q1.3(D)
SWO: IC3.31(PA10)
USB_D_N: IC3.32(PA11) J1.2
USB_D_P: IC3.33(PA12) J1.3 R25.1
USB_RENUM: IC3.38(PA15) R28.1
Unconnected: IC3.3(PC14-OSC32_IN) IC3.4(PC15-OSC32_OUT) IC3.11(PA1) IC3.14(PA4) IC3.16(PA6) IC3.17(PA7) IC3.19(PB1) IC3.21(PB10) IC3.22(PB11) IC3.28(PB15) IC3.29(PA8) IC3.40(PB4) IC3.41(PB5) IC3.42(PB6) IC3.43(PB7) IC3.45(PB8) IC3.46(PB9) SWD1.6(SWO)

### Notes on the sheet
- OCU - ST-LINKV2_1

### Library data of the parts
C2 C3 C19-C24 = CASE-RCL:C0603: Standard Chip CAPACITOR 0605 (1608 Metric) Description: Standard Chip CAPACITOR 0605 (1608 Metric)
D1-D3 = CASE-LED:CHIP-LED0805: CHIP-LED0805 (SMD) Description: Standard 0805 SMD CHIP-LED
F1 = CASE-Fuse:OZCJ: bel OZCJ Series PTC Fuses Description: OZCJ Series resettable PTC fuses from bel. Links: Datasheet <http://www.farnell.com/datasheets/2571638.pdf?_ga=2.17247801.1220548547.1537165482-1535130828.1530438260> 0ZCJ0005FF2E <https://se.farnell.com/bel-circuit-protection/0zcj0005ff2e/s-kring-terst-ll-ptc-60vdc-0-05a/dp/2834879?st=fuse> 0ZCJ0010FF2E <https://se.farnell.com/bel-circuit-protection/0zcj0010ff2e/s-kring-terst-llb-ptc-60vdc-0/dp/2834880?st=fuse> 0ZCJ0012FF2E <https://se.farnell.com/bel-circuit-protection/0zcj0012ff2e/s-kring-terst-ll-ptc-48vdc-0-12a/dp/2834881?st=fuse> 0ZCJ0016FF2E <https://se.farnell.com/bel-circuit-protection/0zcj0016ff2e/s-kring-terst-ll-ptc-48vdc-0-16a/dp/2834882?st=fuse> 0ZCJ0020FF2E <https://se.farnell.com/bel-circuit-protection/0zcj0020ff2e/s-kring-terst-llb-ptc-30vdc-0/dp/2834883?st=fuse> 0ZCJ0025AF2E <https://se.farnell.com/bel-circuit-protection/0zcj0025af2e/s-kring-terst-ll-ptc-24vdc-0-25a/dp/2834884?st=fuse> 0ZCJ0035AF2E <https://se.farnell.com/bel-circuit-protection/0zcj0035af2e/s-kring-terst-ll-ptc-30vdc-0-35a/dp/2834886> 0ZCJ0050AF2E <https://se.farnell.com/bel-circuit-protection/0zcj0050af2e/s-kring-terst-llb-ptc-24vdc-0/dp/2834888?st=fuse> 0ZCJ0075AF2E <https://se.farnell.com/bel-circuit-protection/0zcj0075af2e/s-kring-terst-ll-ptc-16vdc-0-75a/dp/2834890?st=fuse> 0ZCJ0100FF2E <https://se.farnell.com/bel-circuit-protection/0zcj0100ff2e/s-kring-terst-llb-ptc-6vdc-1a/dp/2834892?st=fuse> 0ZCJ0110FF2E <https://se.farnell.com/bel-circuit-protection/0zcj0110ff2e/s-kring-terst-llb-ptc-8vdc-1-1a/dp/2834893> 0ZCJ0150FF2C <https://se.farnell.com/bel-fuse/0zcj0150ff2c/fuse-resettable-ptc-8vdc-1-5a/dp/2848535> 0ZCJ0200FF2C <https://se.farnell.com/bel-circuit-protection/0zcj0200ff2c/s-kring-terst-llb-ptc-6vdc-2a/dp/2834895?st=fuse>
FP1 = CASE-RCL:BLM18A: muRata BLM18A Series Size 0603 Ferrite Pearls Description: BLM18A Series 0603 Size ferrite pearls from muRata. Links: Datasheet <http://www.farnell.com/datasheets/1756147.pdf?_ga=2.78732756.1951585514.1537363662-1535130828.1530438260> BLM18AG601SN1D <https://se.farnell.com/murata/blm18ag601sn1d/ferrite-bead-0603-0-38ohm-0-5a/dp/1515679?st=BLM18AG601SN1D>
IC3 = Programming_interface_lib:STM32F103CBT6TR: STMICROELECTRONICS - STM32F103CBT6TR - ARM MCU, STM32 Family STM32F1 Series Microcontrollers, ARM Cortex-M3, 32bit, 72 MHz, 128 KB, 20 KB Source: Datasheet <https://www.st.com/resource/en/datasheet/stm32f103cb.pdf>; DESCRIPTION: STMICROELECTRONICS - STM32F103CBT6TR - ARM MCU, STM32 Family STM32F1 Series Microcontrollers, ARM Cortex-M3, 32bit, 72 MHz, 128 KB, 20 KB; HEIGHT: 1.6mm; MANUFACTURER_NAME: STMicroelectronics; MANUFACTURER_PART_NUMBER: STM32F103CBT6TR
J1 = Programming_interface_lib:505568-0571: Headers & Wire Housings MicroLockPlus 1.25MM VERT HDR SR 5CKT BLK Source: Datasheet <http://uk.rs-online.com/web/p/products/1615926P>; ALLIED_NUMBER: 71085525; DESCRIPTION: Headers & Wire Housings MicroLockPlus 1.25MM VERT HDR SR 5CKT BLK; HEIGHT: 4.05mm; MANUFACTURER_NAME: Molex; MANUFACTURER_PART_NUMBER: 505568-0571; RS_PART_NUMBER: 1615926P; RS_PRICE-STOCK: http://uk.rs-online.com/web/p/products/1615926P
Q1 = CASE-Transistors:2N7002PW,115: 2N7002PW,115 N-Channel Mosfet (SOT-323) Description: 2N7002PW,115 N-Channel Mosfet in a SOT-323 (SC-70) package Links: 2N7002PW,115 <http://www.farnell.com/datasheets/1760698.pdf?_ga=2.3009012.510093211.1546607516-411290609.1543318711>
Q2 = CASE-Transistors:BC817: BC817 NPN Transistor (SOT-23) Description: Standard BC817 NPN Transistor in a SOT-23 package Links: BC817,215 <http://www.farnell.com/datasheets/699988.pdf?_ga=2.36626660.510093211.1546607516-411290609.1543318711>
R1-R4 R25-R35 = CASE-RCL:R0603: Standard Chip RESISTOR 0603 (1608 Metric) Description: Standard Chip RESISTOR 0603 (1608 Metric)
R36 = CASE-RCL:R0805: Standard Chip RESISTOR 0805 (2012 Metric) Description: Standard Chip RESISTOR 0805 (2012 Metric)
SWD1 = CASE-Prog_Header:SWD_TAGCONNECT: SWD Programming header (Tag-Connect version) Description: SWD Programming header for Tag Connect TC2030-IDC, both legged and no-legged version Links: Tag-Connect <http://www.tag-connect.com/JLINK>
U1 = CASE-Voltage_regulators:LD1117S33TR: LD1117S33TR, 3.3V LDO voltage regulator, SOT-223-4 Description: LD1117S33TR, 3.3V LDO voltage regulator in SOT-223-3 package - Input voltage: 4.75-15V - Output voltage: 3.3V - Output current: 800mA - Dropout voltage: 1.1V Links: Datasheet <http://www.farnell.com/datasheets/1776449.pdf?_ga=2.71508627.1869469127.1547838600-114062766.1547494298>; MPN: LD1117S33TR; OC_FARNELL: 2253484; OC_NEWARK: 89K0627; PACKAGE: SOT223-3; SUPPLIER: STMicroelectronics
Y2 = Programming_interface_lib:NX3225GD-8MHZ-STD-CRA-3: A small surface-mount type crystal unit, ideal for an engine control CPU clock; delivering the high reliability that is particularly demanded by automotive Source: Datasheet <http://uk.rs-online.com/web/p/products/1847983>; DESCRIPTION: A small surface-mount type crystal unit, ideal for an engine control CPU clock; delivering the high reliability that is particularly demanded by automotive; HEIGHT: 1mm; MANUFACTURER_NAME: NDK; MANUFACTURER_PART_NUMBER: NX3225GD-8MHZ-STD-CRA-3; RS_PART_NUMBER: 1847983; RS_PRICE-STOCK: http://uk.rs-online.com/web/p/products/1847983

## Net classes
0 default: width 0.2 mm
1 DB: width 3.2 mm, clearance 0.254 mm